# Altium project TSAL2.PrjPcb
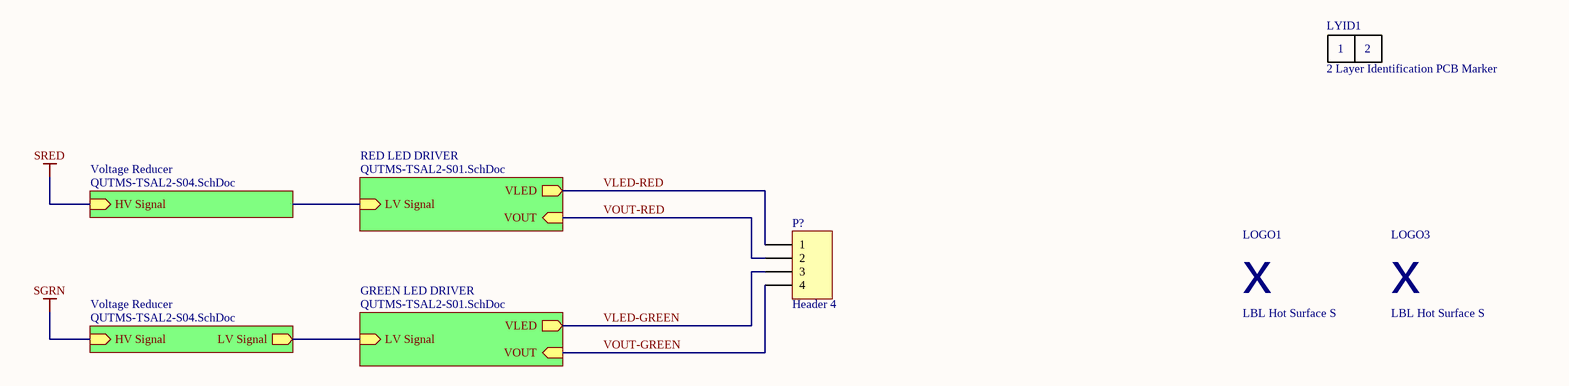
[diagram p0: QUTMS-TSAL2-S00.SchDoc]
3 sheets, 20 parts. Net scope: hierarchical (ports join the sheet entries above them; power ports are global).
Sheets:
  QUTMS-TSAL2-S00.SchDoc
    RED LED DRIVER = QUTMS-TSAL2-S01.SchDoc
    GREEN LED DRIVER = QUTMS-TSAL2-S01.SchDoc
    Voltage Reducer = QUTMS-TSAL2-S04.SchDoc
    Voltage Reducer = QUTMS-TSAL2-S04.SchDoc

## Sheet QUTMS-TSAL2-S00.SchDoc: Tractive System Active Light - TSAL
size A3; DrawnBy: Joseph Richards; DocumentNumber: 1; Revision: 2; SheetNumber: 1; SheetTotal: 3

### Parts
LOGO1  LBL Hot Surface S  [LBL HOT SMALL]
LOGO3  LBL Hot Surface S  [LBL HOT SMALL]
LYID1  2 Layer Identification PCB Marker  [LAYER IDENT 2]
P?  Header 4  [HDR1X4]

### Sub-sheets
GREEN LED DRIVER = QUTMS-TSAL2-S01.SchDoc: VLED (out), VOUT (in), LV Signal (in)
RED LED DRIVER = QUTMS-TSAL2-S01.SchDoc: VLED (out), VOUT (in), LV Signal (in)
Voltage Reducer = QUTMS-TSAL2-S04.SchDoc: HV Signal (in)
Voltage Reducer = QUTMS-TSAL2-S04.SchDoc: HV Signal (in), LV Signal (out)

### Nets
VLED-GREEN: P?.3 ; sheet GREEN LED DRIVER/VLED
VLED-RED: P?.1 ; sheet RED LED DRIVER/VLED
VOUT-GREEN: P?.4 ; sheet GREEN LED DRIVER/VOUT
VOUT-RED: P?.2 ; sheet RED LED DRIVER/VOUT
NetD1_Voltage_Reducer#2_K: sheet GREEN LED DRIVER/LV Signal, sheet Voltage Reducer/LV Signal

### Notes on the sheet
- Revision History:
- Sheet Title:
- Rev
- Date
- Description
- Project:
- Size:
- Drawn By:
- A3
- Number:
- Revision:
- Sheet
- Version:
- of
- QUT Motorsport
- O-120, Gardens Point
- 2 George Street
- Brisbane, QLD 4000
- Australia
- Print Date:
- Print Time:
- File Name:
- (in symbol Layer Identification 2) 1; 2
- (in symbol LBL Hot Surface S) x

### Library data of the parts
LYID1 = Layer Identification 2
P? = Header 4: Header, 4-Pin; LatestRevisionDate: 17-Jul-2002; LatestRevisionNote: Re-released for DXP Platform.; Publisher: Altium Limited

## Sheet QUTMS-TSAL2-S01.SchDoc: LED Driver
size A3; DrawnBy: Joseph Richards; DocumentNumber: 2; Revision: 2; SheetNumber: 3; SheetTotal: 3
Used 2 times, as channels RED LED DRIVER, GREEN LED DRIVER. Parts and nets are listed once, with the designators drawn on the sheet.
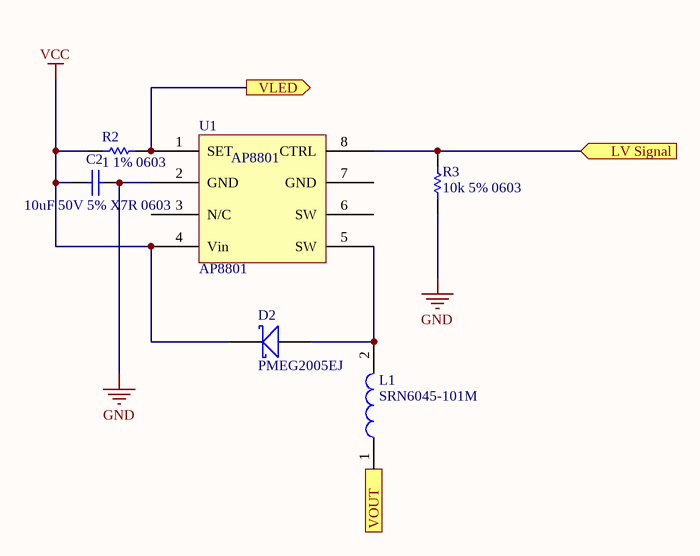
[diagram p1: QUTMS-TSAL2-S01.SchDoc]

### Parts
C2  10uF 50V 5% X7R 0603  [Cap_Ceramic_0603(10uf)]
D2  PMEG2005EJ  [SOD-323F(shottkey)]
L1  SRN6045-101M  [Bourns Inductor 6x6x4.5mm(100mH)]
R2  1 1% 0603  [Res_ThinFilm_0603 (1,10k)]
R3  10k 5% 0603  [Res_ThinFilm_0603 (1,10k)]
U1  AP8801  [SOP8/SO8(AP8801)]

### Ports
LV Signal (in), VLED (out), VOUT (in)

### Nets
GND: C2.2 R3.1 U1.2(GND)
VCC: C2.1 D2.K(Cathode) R2.1 U1.4(Vin)
LV Signal: R3.2 U1.8(CTRL) ; port LV Signal
VLED: R2.2 U1.1(SET) ; port VLED
VOUT: L1.1 ; port VOUT
NetD2_A: D2.A(Anode) L1.2 U1.5(SW)

Not connected (* = marked no-connect by the designer): U1 3(N/C) 6(SW) 7(GND)

### Channels
RED LED DRIVER: designators end in _RED_LED_DRIVER; ports LV Signal=NetR3_RED_LED_DRIVER_2 VLED=VLED-RED VOUT=VOUT-RED
GREEN LED DRIVER: designators end in _GREEN_LED_DRIVER; ports LV Signal=NetD1_Voltage_Reducer#2_K VLED=VLED-GREEN VOUT=VOUT-GREEN

### Notes on the sheet
- Revision History:
- Sheet Title:
- Rev
- Date
- Description
- Project:
- Size:
- Drawn By:
- A3
- Number:
- Revision:
- Sheet
- Version:
- of
- QUT Motorsport
- O-120, Gardens Point
- 2 George Street
- Brisbane, QLD 4000
- Australia
- Print Date:
- Print Time:
- File Name:

### Library data of the parts
C2 = 10uF 50V 5% X7R 0603: Capacitor, Ceramic, SMD, 10uF, 50V, 5%, X7R, 0603
D2 = PMEG2005EJ: Diode, Schottky, SMD, 20 V, 500 mA, Single, SOD-323F, 2 Pins, 390 mV; ComponentLink1Description: Element14; ComponentLink1URL: https://au.element14.com/nexperia/pmeg2005ej-115/schottky-rect-20v-0-5a-sod323f/dp/1757760
L1 = SRN6045-101M: Inductor, 100 µH, 700 mA, Semishielded, 800 mA, SRN6045 Series, 6mm x 6mm x 4.5mm; ComponentLink1Description: Element14; ComponentLink1URL: https://au.element14.com/bourns/srn6045-101m/inductor-100uh-semi-shielded-power/dp/2061658
R2 = 1 1% 0603: Resistor, SMD, 1, 0.1W, 1%, 0603
R3 = 10k 5% 0603: Resistor, SMD, 10k, 0.1W, 5%, 0603
U1 = AP8801: the LED drver fotr the red and green LED's

## Sheet QUTMS-TSAL2-S04.SchDoc: Zener Voltage Regulator
size A3; DrawnBy: Joseph Richards; DocumentNumber: 5; Revision: 2; SheetNumber: 2; SheetTotal: 3
Used 2 times, as channels Voltage Reducer, Voltage Reducer. Parts and nets are listed once, with the designators drawn on the sheet.
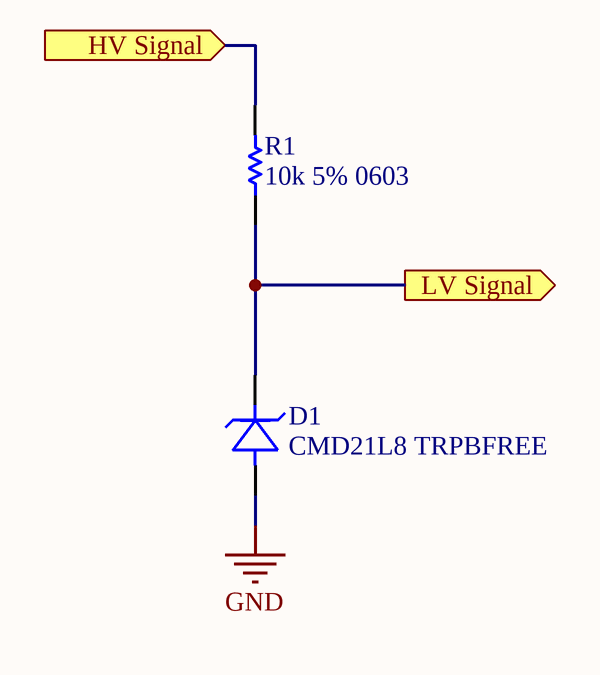
[diagram p2: QUTMS-TSAL2-S04.SchDoc]

### Parts
D1  CMD21L8 TRPBFREE  [SODFL160X80-2N(Zener)]
R1  10k 5% 0603  [Res_ThinFilm_0603 (1,10k)]

### Ports
HV Signal (in), LV Signal (out)

### Nets
GND: D1.A(Anode)
HV Signal: R1.2 ; port HV Signal
LV Signal: D1.K(Cathode) R1.1 ; port LV Signal

### Channels
Voltage Reducer: designators end in _Voltage_Reducer#1; ports HV Signal=SRED LV Signal=NetD1_Voltage_Reducer#1_K
Voltage Reducer: designators end in _Voltage_Reducer#2; ports HV Signal=SGRN LV Signal=NetD1_Voltage_Reducer#2_K

### Notes on the sheet
- Revision History:
- Sheet Title:
- Rev
- Date
- Description
- Project:
- Size:
- Drawn By:
- A3
- Number:
- Revision:
- Sheet
- Version:
- of
- QUT Motorsport
- O-120, Gardens Point
- 2 George Street
- Brisbane, QLD 4000
- Australia
- Print Date:
- Print Time:
- File Name:

### Library data of the parts
R1 = 10k 5% 0603: Resistor, SMD, 10k, 0.1W, 5%, 0603

## Nets that join several sheets
GND: RED LED DRIVER (C2_RED_LED_DRIVER.2 R3_RED_LED_DRIVER.1 U1_RED_LED_DRIVER.2), GREEN LED DRIVER (C2_GREEN_LED_DRIVER.2 R3_GREEN_LED_DRIVER.1 U1_GREEN_LED_DRIVER.2), Voltage Reducer (D1_Voltage_Reducer#1.A), Voltage Reducer (D1_Voltage_Reducer#2.A)
VCC: RED LED DRIVER (C2_RED_LED_DRIVER.1 D2_RED_LED_DRIVER.K R2_RED_LED_DRIVER.1 U1_RED_LED_DRIVER.4), GREEN LED DRIVER (C2_GREEN_LED_DRIVER.1 D2_GREEN_LED_DRIVER.K R2_GREEN_LED_DRIVER.1 U1_GREEN_LED_DRIVER.4)
NetD1_Voltage_Reducer#2_K: GREEN LED DRIVER (R3_GREEN_LED_DRIVER.2 U1_GREEN_LED_DRIVER.8), Voltage Reducer (D1_Voltage_Reducer#2.K R1_Voltage_Reducer#2.1)
VLED-GREEN: QUTMS-TSAL2-S00 (P?.3), GREEN LED DRIVER (R2_GREEN_LED_DRIVER.2 U1_GREEN_LED_DRIVER.1)
VLED-RED: QUTMS-TSAL2-S00 (P?.1), RED LED DRIVER (R2_RED_LED_DRIVER.2 U1_RED_LED_DRIVER.1)
VOUT-GREEN: QUTMS-TSAL2-S00 (P?.4), GREEN LED DRIVER (L1_GREEN_LED_DRIVER.1)
VOUT-RED: QUTMS-TSAL2-S00 (P?.2), RED LED DRIVER (L1_RED_LED_DRIVER.1)